# EAGLE design DJ CONTROLLER (EAGLE 7.6.0)
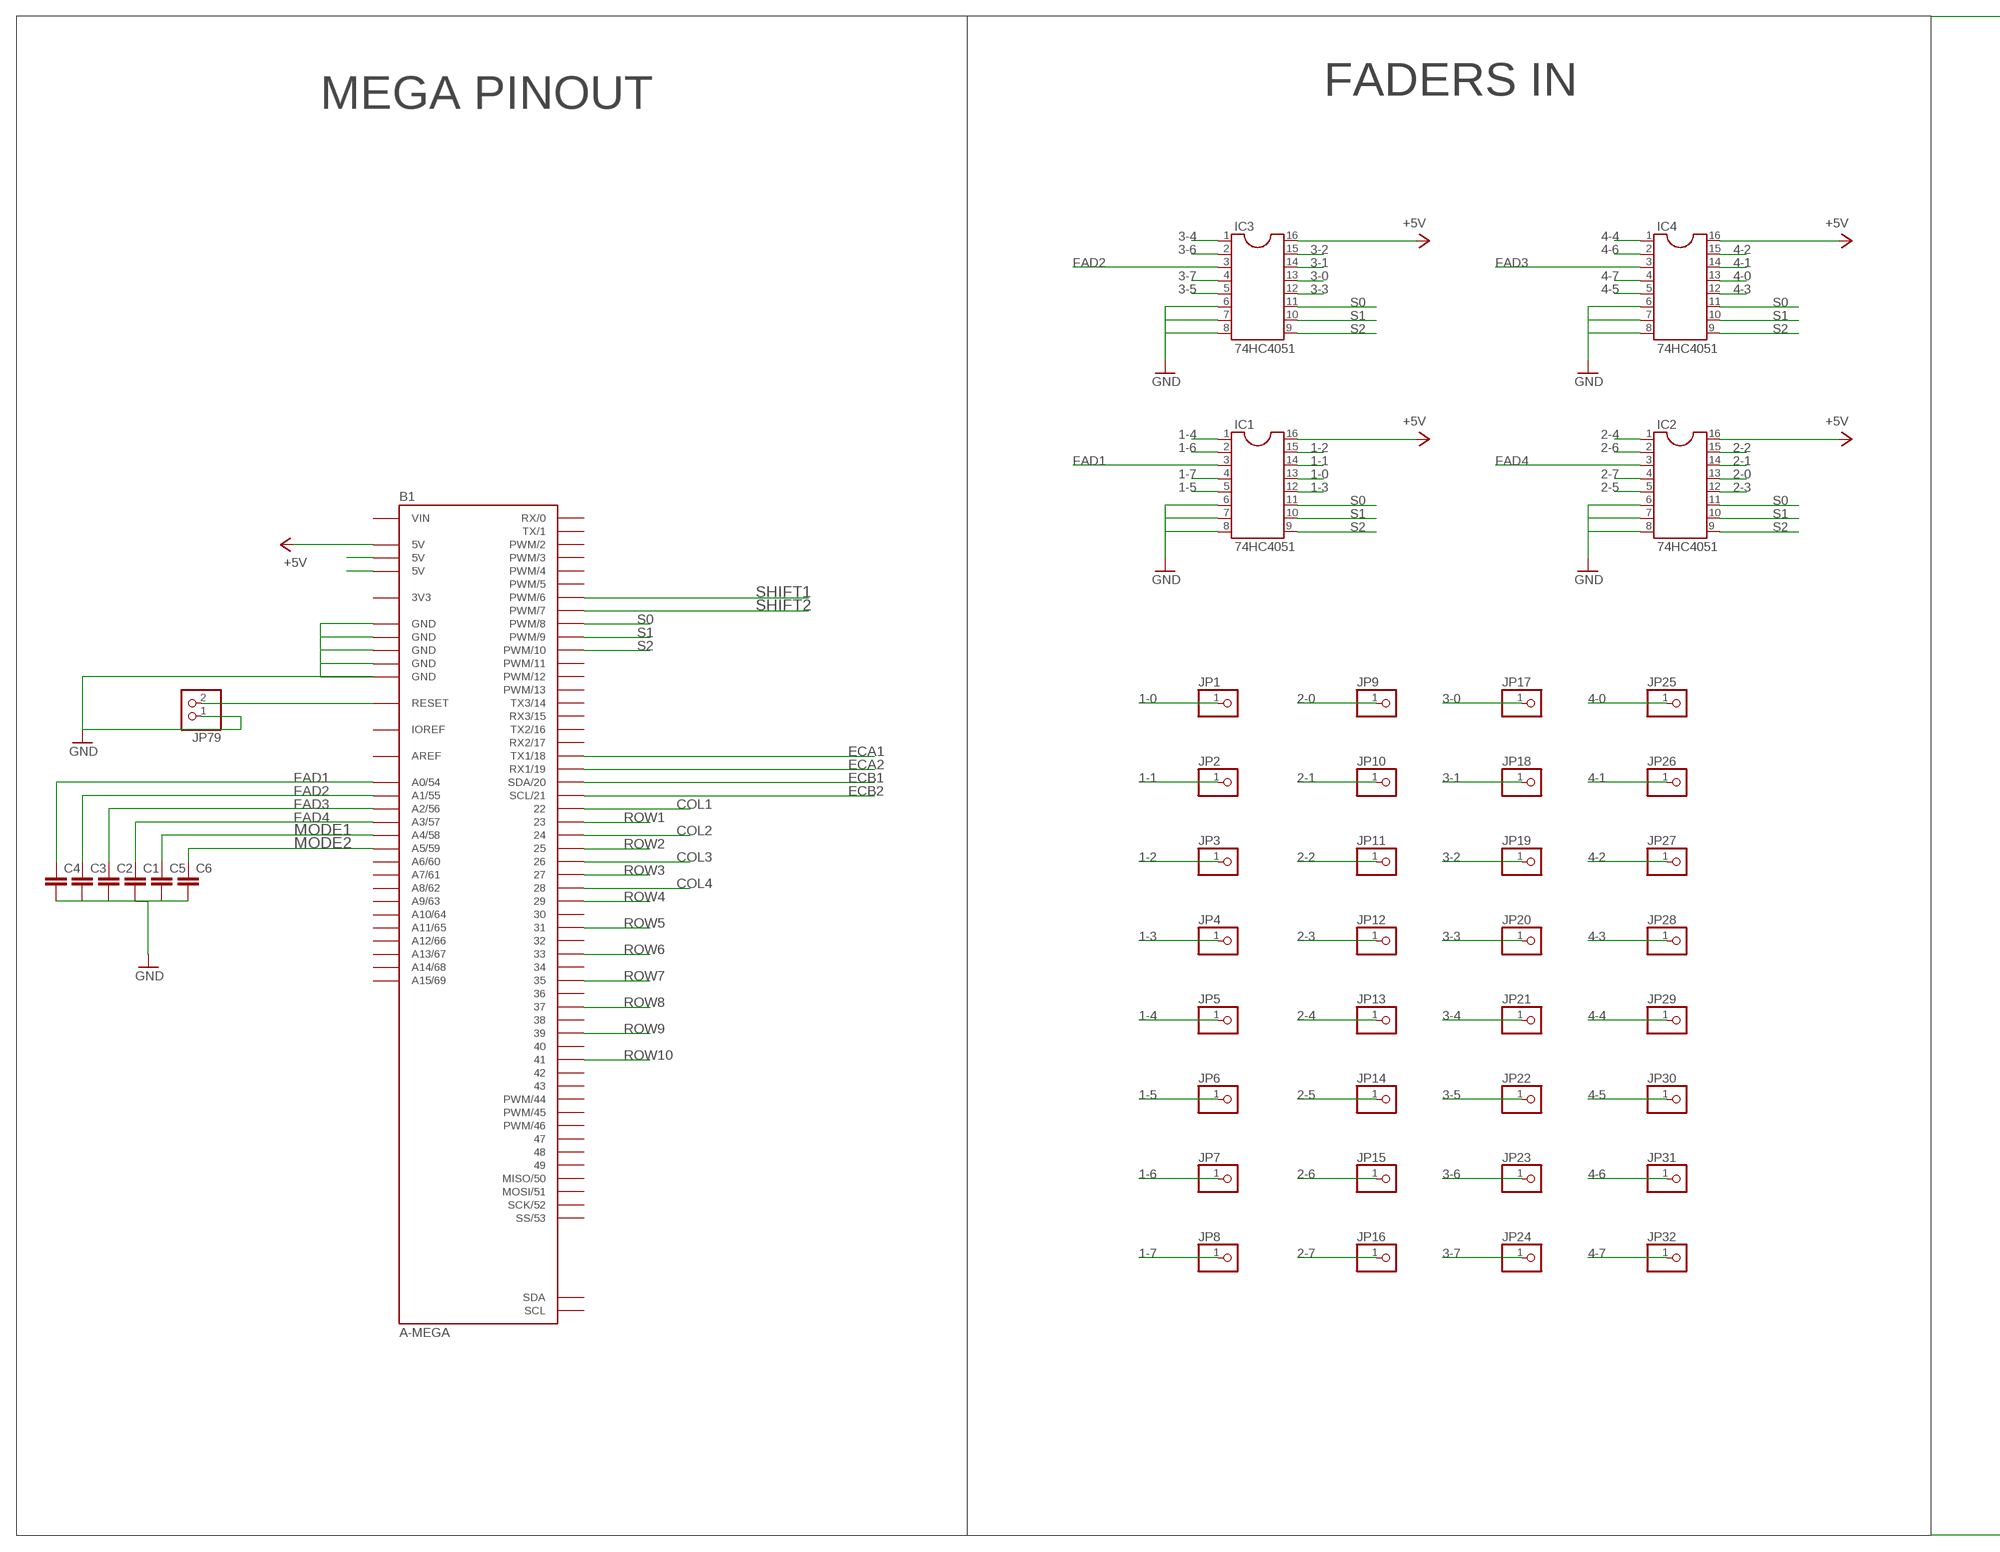
[diagram p0: schematic, sheet 1, part 1 of 2]
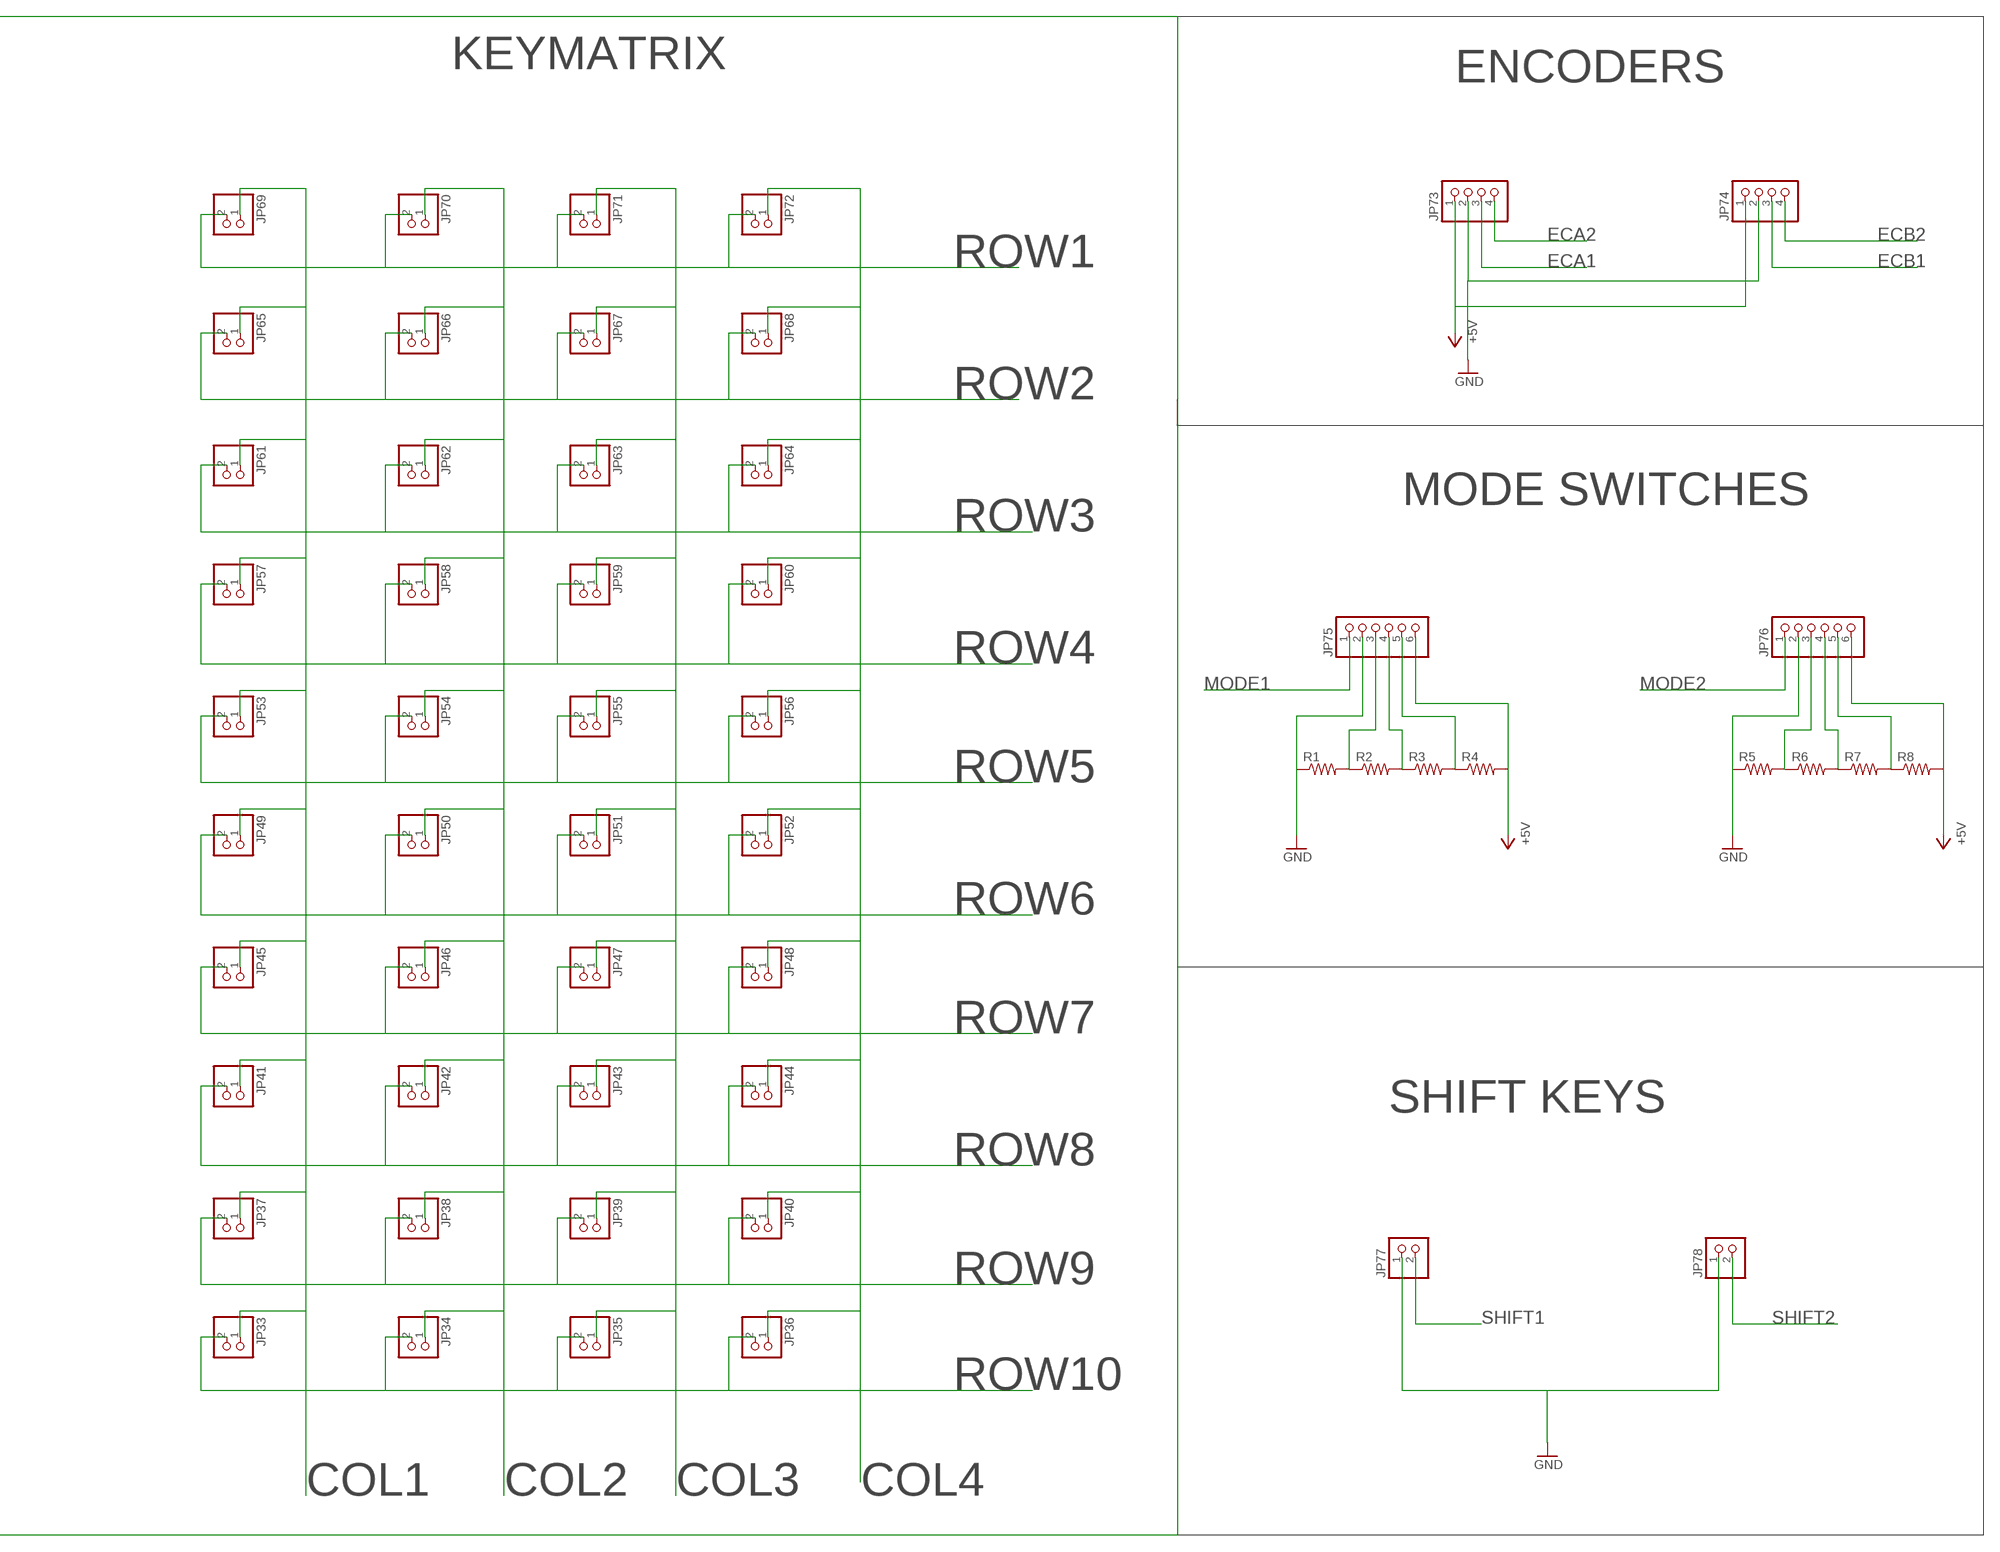
[diagram p1: schematic, sheet 1, part 2 of 2]

## Parts
B1  A-MEGA  [A-MEGA]
C1  C-EU050-025X075  [C050-025X075]
C2  C-EU050-025X075  [C050-025X075]
C3  C-EU050-025X075  [C050-025X075]
C4  C-EU050-025X075  [C050-025X075]
C5  C-EU050-025X075  [C050-025X075]
C6  C-EU050-025X075  [C050-025X075]
IC1  74HC4051  DIL16S  [SOCKET-16]
IC2  74HC4051  DIL16S  [SOCKET-16]
IC3  74HC4051  DIL16S  [SOCKET-16]
IC4  74HC4051  DIL16S  [SOCKET-16]
JP1  PINHD-1X1  [1X01]
JP2  PINHD-1X1  [1X01]
JP3  PINHD-1X1  [1X01]
JP4  PINHD-1X1  [1X01]
JP5  PINHD-1X1  [1X01]
JP6  PINHD-1X1  [1X01]
JP7  PINHD-1X1  [1X01]
JP8  PINHD-1X1  [1X01]
JP9  PINHD-1X1  [1X01]
JP10  PINHD-1X1  [1X01]
JP11  PINHD-1X1  [1X01]
JP12  PINHD-1X1  [1X01]
JP13  PINHD-1X1  [1X01]
JP14  PINHD-1X1  [1X01]
JP15  PINHD-1X1  [1X01]
JP16  PINHD-1X1  [1X01]
JP17  PINHD-1X1  [1X01]
JP18  PINHD-1X1  [1X01]
JP19  PINHD-1X1  [1X01]
JP20  PINHD-1X1  [1X01]
JP21  PINHD-1X1  [1X01]
JP22  PINHD-1X1  [1X01]
JP23  PINHD-1X1  [1X01]
JP24  PINHD-1X1  [1X01]
JP25  PINHD-1X1  [1X01]
JP26  PINHD-1X1  [1X01]
JP27  PINHD-1X1  [1X01]
JP28  PINHD-1X1  [1X01]
JP29  PINHD-1X1  [1X01]
JP30  PINHD-1X1  [1X01]
JP31  PINHD-1X1  [1X01]
JP32  PINHD-1X1  [1X01]
JP33  PINHD-1X2  [1X02]
JP34  PINHD-1X2  [1X02]
JP35  PINHD-1X2  [1X02]
JP36  PINHD-1X2  [1X02]
JP37  PINHD-1X2  [1X02]
JP38  PINHD-1X2  [1X02]
JP39  PINHD-1X2  [1X02]
JP40  PINHD-1X2  [1X02]
JP41  PINHD-1X2  [1X02]
JP42  PINHD-1X2  [1X02]
JP43  PINHD-1X2  [1X02]
JP44  PINHD-1X2  [1X02]
JP45  PINHD-1X2  [1X02]
JP46  PINHD-1X2  [1X02]
JP47  PINHD-1X2  [1X02]
JP48  PINHD-1X2  [1X02]
JP49  PINHD-1X2  [1X02]
JP50  PINHD-1X2  [1X02]
JP51  PINHD-1X2  [1X02]
JP52  PINHD-1X2  [1X02]
JP53  PINHD-1X2  [1X02]
JP54  PINHD-1X2  [1X02]
JP55  PINHD-1X2  [1X02]
JP56  PINHD-1X2  [1X02]
JP57  PINHD-1X2  [1X02]
JP58  PINHD-1X2  [1X02]
JP59  PINHD-1X2  [1X02]
JP60  PINHD-1X2  [1X02]
JP61  PINHD-1X2  [1X02]
JP62  PINHD-1X2  [1X02]
JP63  PINHD-1X2  [1X02]
JP64  PINHD-1X2  [1X02]
JP65  PINHD-1X2  [1X02]
JP66  PINHD-1X2  [1X02]
JP67  PINHD-1X2  [1X02]
JP68  PINHD-1X2  [1X02]
JP69  PINHD-1X2  [1X02]
JP70  PINHD-1X2  [1X02]
JP71  PINHD-1X2  [1X02]
JP72  PINHD-1X2  [1X02]
JP73  PINHD-1X4  [1X04]
JP74  PINHD-1X4  [1X04]
JP75  PINHD-1X6  [1X06]
JP76  PINHD-1X6  [1X06]
JP77  PINHD-1X2  [1X02]
JP78  PINHD-1X2  [1X02]
JP79  PINHD-1X2  [1X02]
R1  R-US_0204/7  [0204/7]
R2  R-US_0204/7  [0204/7]
R3  R-US_0204/7  [0204/7]
R4  R-US_0204/7  [0204/7]
R5  R-US_0204/7  [0204/7]
R6  R-US_0204/7  [0204/7]
R7  R-US_0204/7  [0204/7]
R8  R-US_0204/7  [0204/7]

## Nets
1-0: IC1.13 JP1.1
1-1: IC1.14 JP2.1
1-2: IC1.15 JP3.1
1-3: IC1.12 JP4.1
1-4: IC1.1 JP5.1
1-5: IC1.5 JP6.1
1-6: IC1.2 JP7.1
1-7: IC1.4 JP8.1
2-0: IC2.13 JP9.1
2-1: IC2.14 JP10.1
2-2: IC2.15 JP11.1
2-3: IC2.12 JP12.1
2-4: IC2.1 JP13.1
2-5: IC2.5 JP14.1
2-6: IC2.2 JP15.1
2-7: IC2.4 JP16.1
3-0: IC3.13 JP17.1
3-1: IC3.14 JP18.1
3-2: IC3.15 JP19.1
3-3: IC3.12 JP20.1
3-4: IC3.1 JP21.1
3-5: IC3.5 JP22.1
3-6: IC3.2 JP23.1
3-7: IC3.4 JP24.1
4-0: IC4.13 JP25.1
4-1: IC4.14 JP26.1
4-2: IC4.15 JP27.1
4-3: IC4.12 JP28.1
4-4: IC4.1 JP29.1
4-5: IC4.5 JP30.1
4-6: IC4.2 JP31.1
4-7: IC4.4 JP32.1
+5V: B1.5V@1(5V) IC1.16 IC2.16 IC3.16 IC4.16 JP73.1 JP74.1 JP75.6 JP76.6 R4.2 R8.2
COL1: B1.22 JP33.1 JP37.1 JP41.1 JP45.1 JP49.1 JP53.1 JP57.1 JP61.1 JP65.1 JP69.1
COL2: B1.24 JP34.1 JP38.1 JP42.1 JP46.1 JP50.1 JP54.1 JP58.1 JP62.1 JP66.1 JP70.1
COL3: B1.26 JP35.1 JP39.1 JP43.1 JP47.1 JP51.1 JP55.1 JP59.1 JP63.1 JP67.1 JP71.1
COL4: B1.28 JP36.1 JP40.1 JP44.1 JP48.1 JP52.1 JP56.1 JP60.1 JP64.1 JP68.1 JP72.1
ECA1: B1.18(TX1/18) JP73.3
ECA2: B1.19(RX1/19) JP73.4
ECB1: B1.20(SDA/20) JP74.3
ECB2: B1.21(SCL/21) JP74.4
FAD1: B1.A0(A0/54) C4.1 IC1.3
FAD2: B1.A1(A1/55) C3.1 IC3.3
FAD3: B1.A2(A2/56) C2.1 IC4.3
FAD4: B1.A3(A3/57) C1.1 IC2.3
GND: B1.GND@1(GND) B1.GND@2(GND) B1.GND@3(GND) B1.GND@4(GND) B1.GND@5(GND) C1.2 C2.2 C3.2 C4.2 C5.2 C6.2 IC1.6 IC1.7 IC1.8 IC2.6 IC2.7 IC2.8 IC3.6 IC3.7 IC3.8 IC4.6 IC4.7 IC4.8 JP73.2 JP74.2 JP75.2 JP76.2 JP77.1 JP78.1 JP79.1 R1.1 R5.1
MODE1: B1.A4(A4/58) C5.1 JP75.1
MODE2: B1.A5(A5/59) C6.1 JP76.1
N$34: JP76.3 R5.2 R6.1
N$35: JP75.3 R1.2 R2.1
N$36: JP75.4 R2.2 R3.1
N$37: JP75.5 R3.2 R4.1
N$38: JP76.4 R6.2 R7.1
N$39: JP76.5 R7.2 R8.1
N$41: B1.5V@2(5V)
N$42: B1.5V@3(5V)
N$43: B1.RST(RESET) JP79.2
ROW1: B1.23 JP69.2 JP70.2 JP71.2 JP72.2
ROW2: B1.25 JP65.2 JP66.2 JP67.2 JP68.2
ROW3: B1.27 JP61.2 JP62.2 JP63.2 JP64.2
ROW4: B1.29 JP57.2 JP58.2 JP59.2 JP60.2
ROW5: B1.31 JP53.2 JP54.2 JP55.2 JP56.2
ROW6: B1.33 JP49.2 JP50.2 JP51.2 JP52.2
ROW7: B1.35 JP45.2 JP46.2 JP47.2 JP48.2
ROW8: B1.37 JP41.2 JP42.2 JP43.2 JP44.2
ROW9: B1.39 JP37.2 JP38.2 JP39.2 JP40.2
ROW10: B1.41 JP33.2 JP34.2 JP35.2 JP36.2
S0: B1.8(PWM/8) IC1.11 IC2.11 IC3.11 IC4.11
S1: B1.9(PWM/9) IC1.10 IC2.10 IC3.10 IC4.10
S2: B1.10(PWM/10) IC1.9 IC2.9 IC3.9 IC4.9
SHIFT1: B1.6(PWM/6) JP77.2
SHIFT2: B1.7(PWM/7) JP78.2
Unconnected: B1.0(RX/0) B1.1(TX/1) B1.2(PWM/2) B1.3(PWM/3) B1.4(PWM/4) B1.5(PWM/5) B1.11(PWM/11) B1.12(PWM/12) B1.13(PWM/13) B1.14(TX3/14) B1.15(RX3/15) B1.16(TX2/16) B1.17(RX2/17) B1.30 B1.32 B1.34 B1.36 B1.38 B1.40 B1.42 B1.43 B1.44(PWM/44) B1.45(PWM/45) B1.46(PWM/46) B1.47 B1.48 B1.49 B1.50(MISO/50) B1.51(MOSI/51) B1.52(SCK/52) B1.53(SS/53) B1.A6(A6/60) B1.A7(A7/61) B1.A8(A8/62) B1.A9(A9/63) B1.A10(A10/64) B1.A11(A11/65) B1.A12(A12/66) B1.A13(A13/67) B1.A14(A14/68) B1.A15(A15/69) B1.SCL B1.SDA

## Notes on the sheet
- KEYMATRIX | ENCODERS
- MEGA PINOUT | FADERS IN
- MODE SWITCHES
- SHIFT KEYS

## Power pins joined to a net without a drawn wire
3V3: B1.3V3
AREF: B1.AREF
IOREF: B1.IOREF
VIN: B1.VIN

## Library data of the parts
B1 = we-board:A-MEGA: Arduino/Genuino Mega
C1-C6 = resistor:C-EU: CAPACITOR, European symbol
IC1-IC4 = ic-package:DIL16: Dual In Line / Socket
JP1-JP32 = pinhead:PINHD-1X1: PIN HEADER
JP33-JP72 JP77-JP79 = pinhead:PINHD-1X2: PIN HEADER
JP73 JP74 = pinhead:PINHD-1X4: PIN HEADER
JP75 JP76 = pinhead:PINHD-1X6: PIN HEADER
R1-R8 = resistor:R-US_: RESISTOR, American symbol

## Board
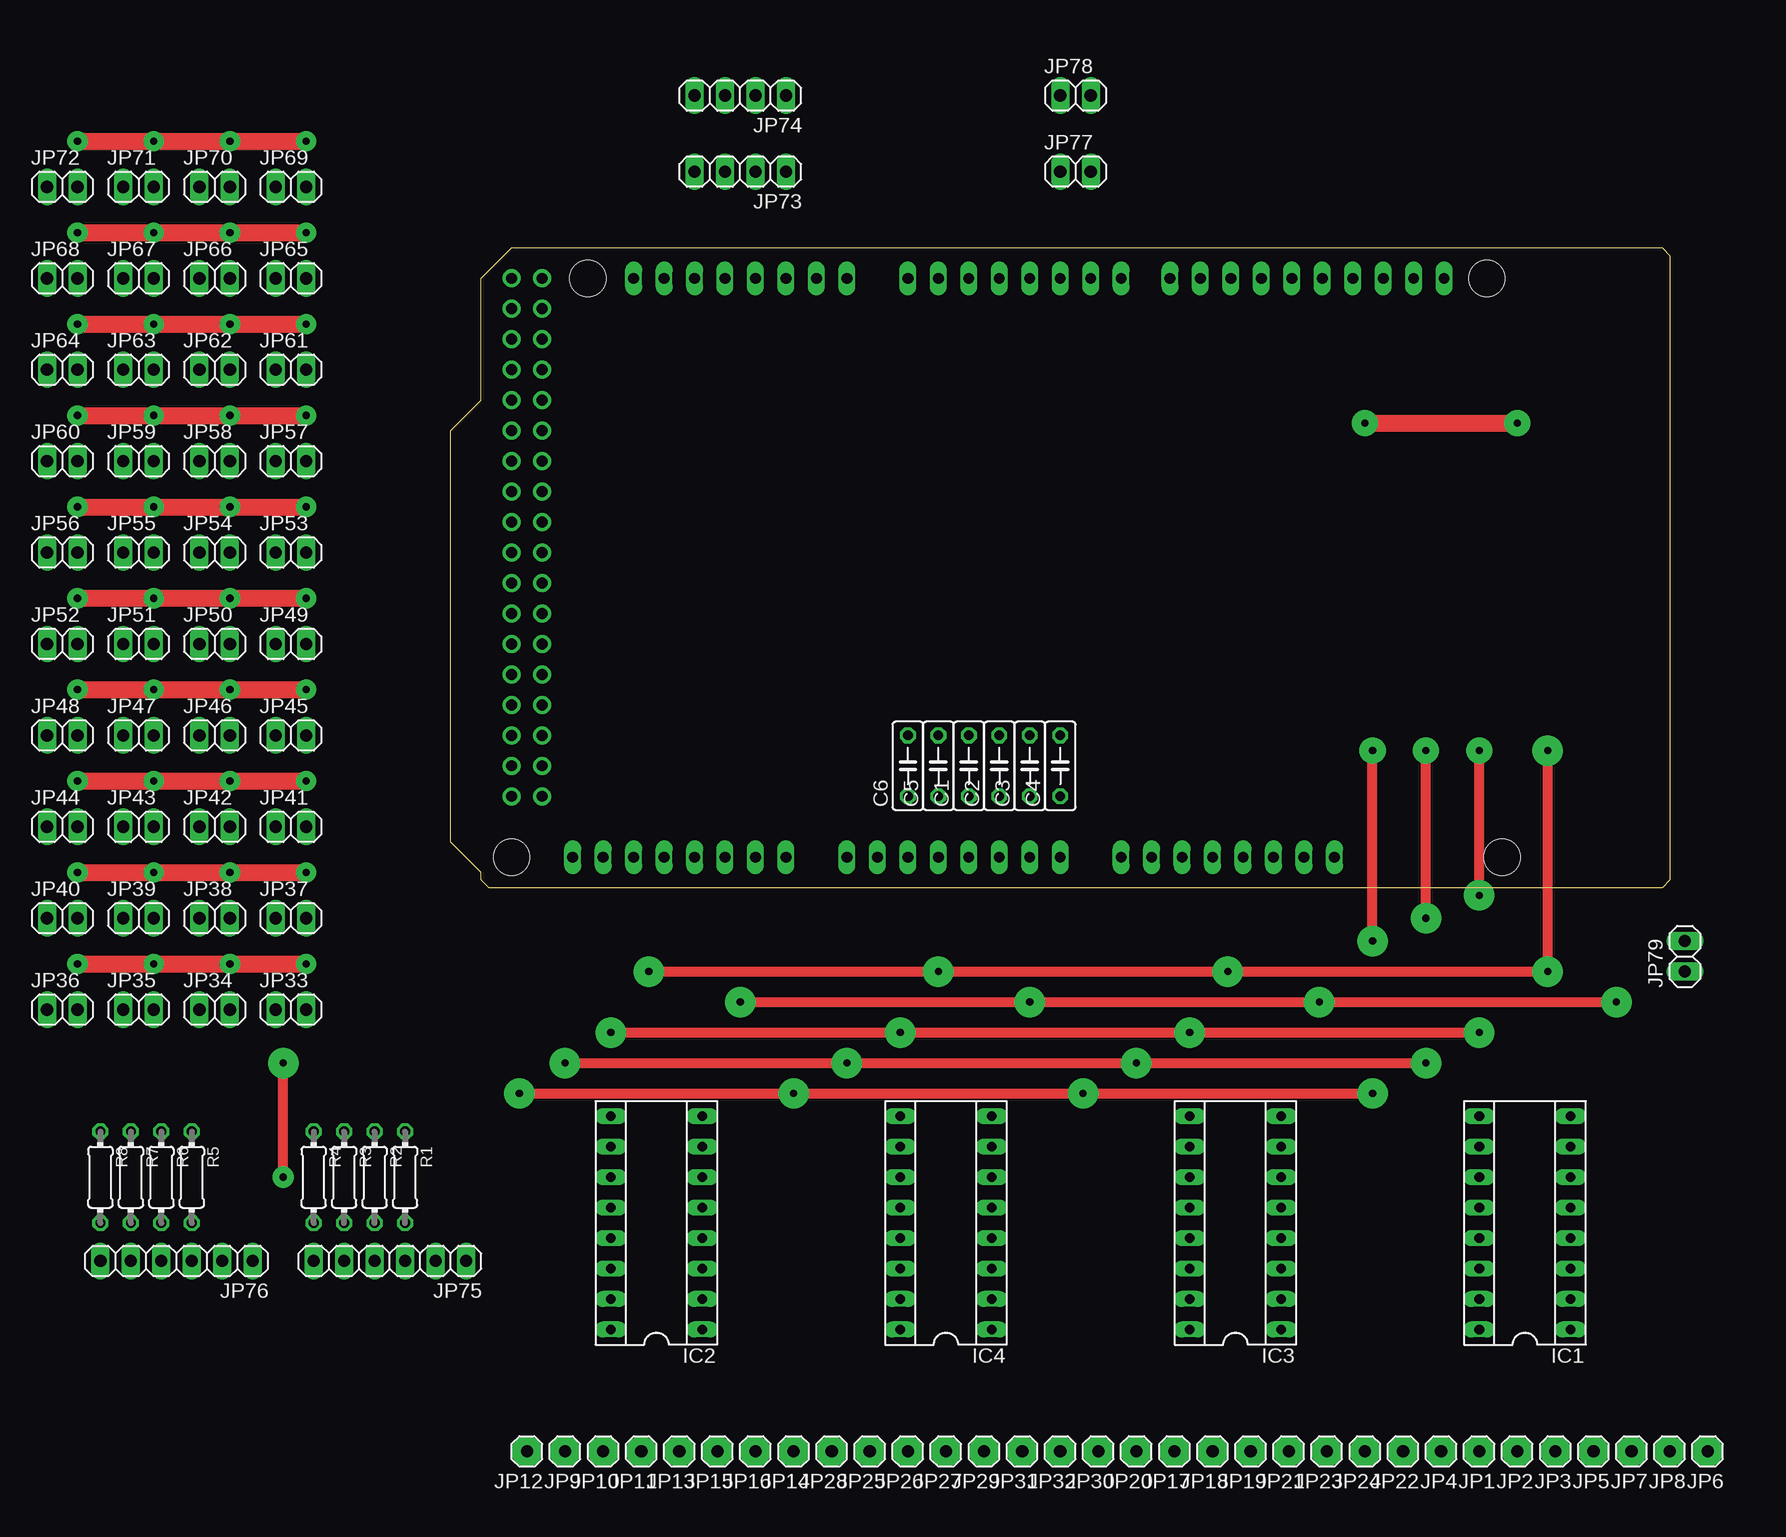
[diagram p2: board, top side]
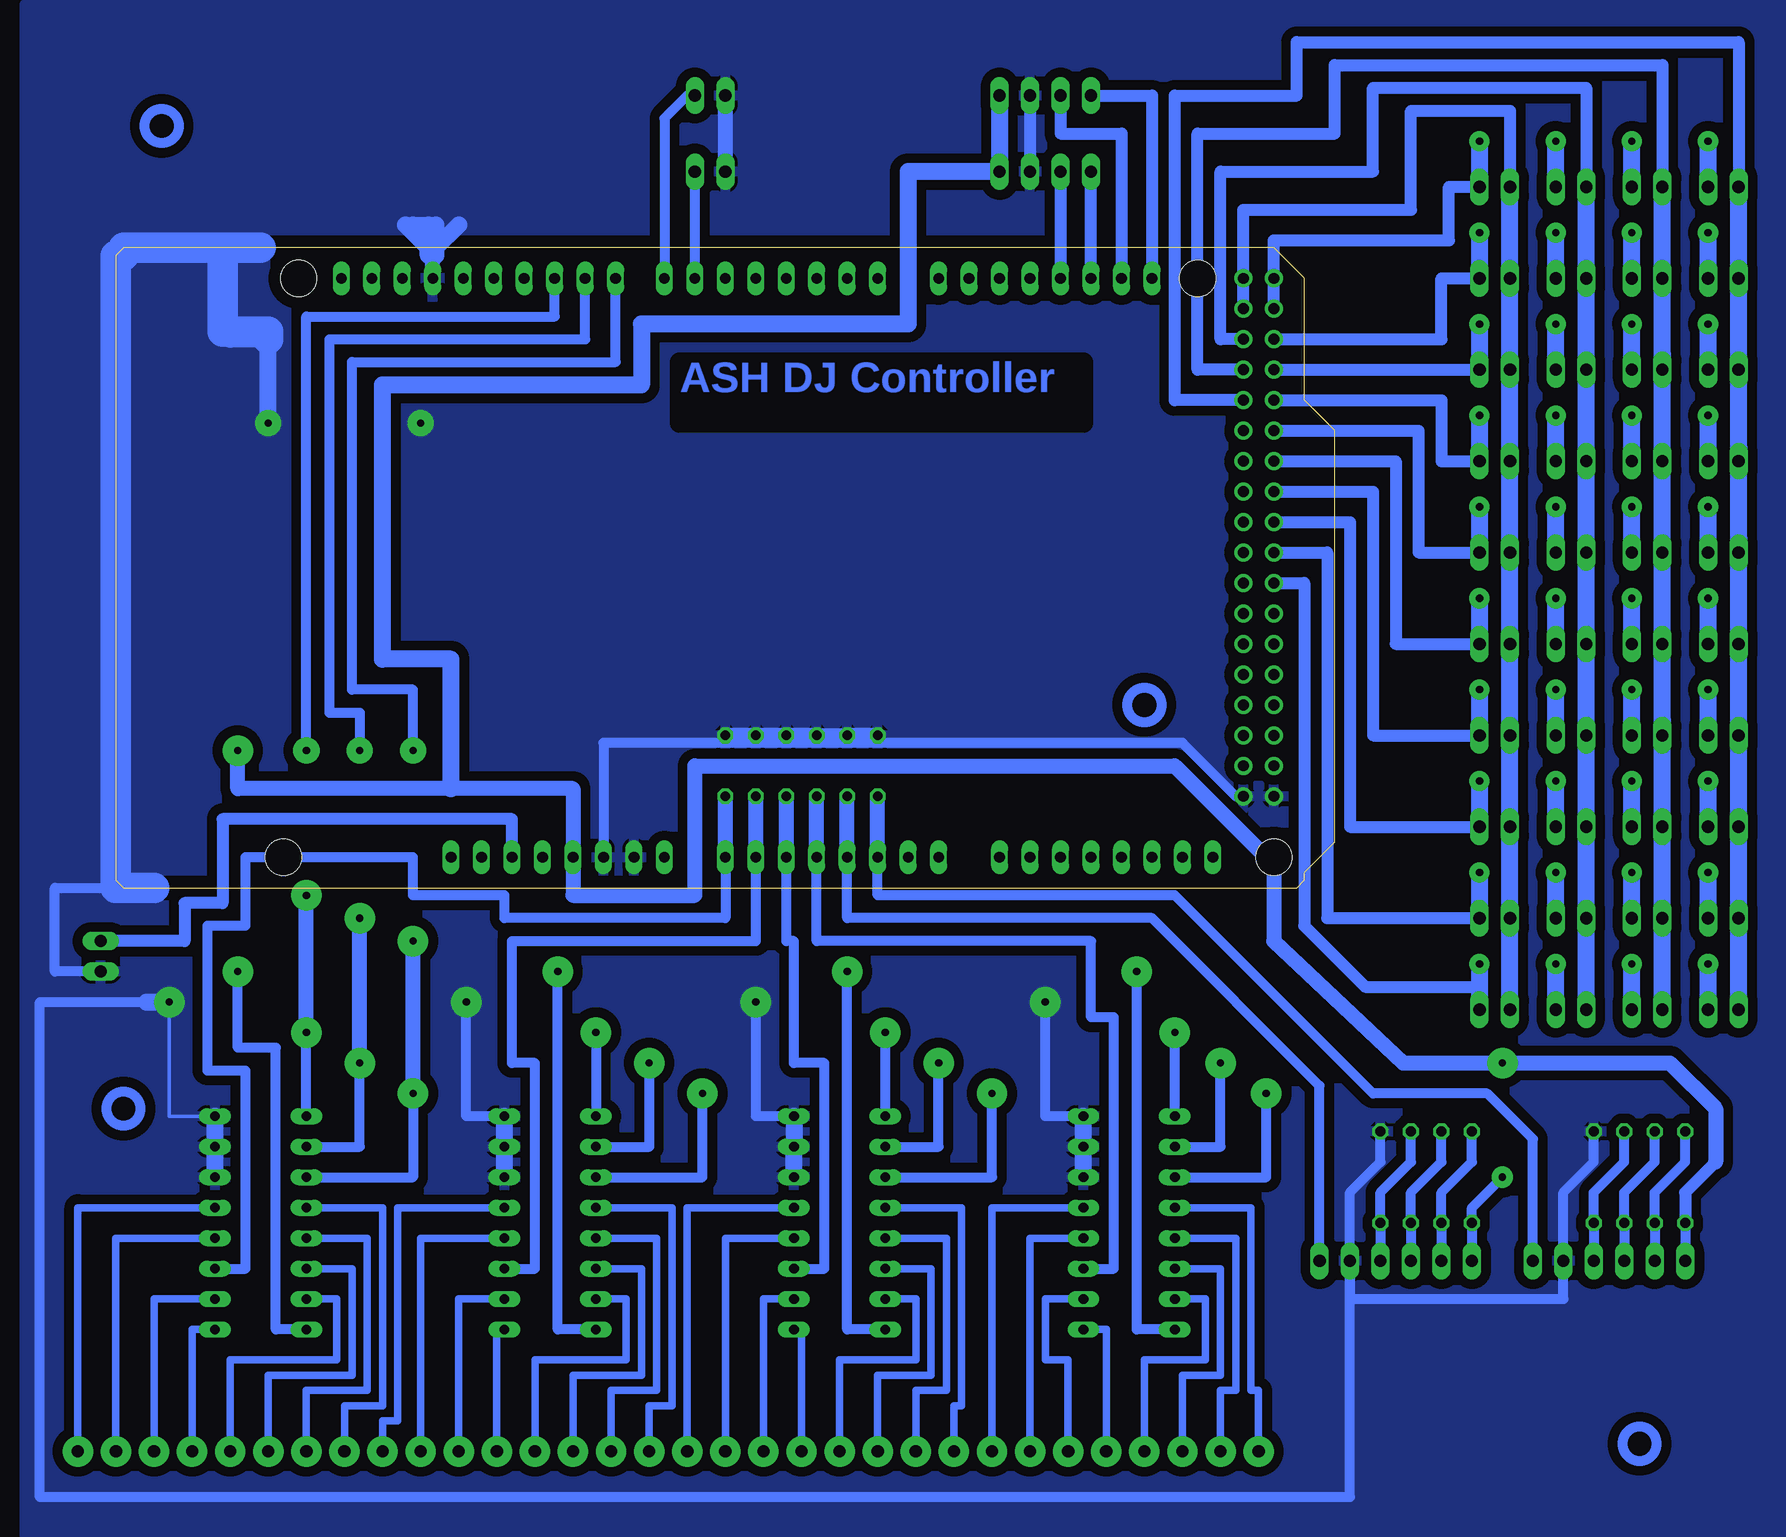
[diagram p3: board, bottom side, seen from below]

Size 101.6 x 53.34 mm. Coordinates in mm from the lower left corner, seen from the top.
Copper layers (1*16): Top 0.035mm / dielectric 1.5mm / Bottom 0.035mm
Design rules "default": minimum track width 10mil, minimum drill 24mil, track to track 8mil, track to pad 8mil, pad to pad 8mil, via to via 8mil, smd to smd 8mil, copper to edge 40mil, drill to drill 8mil, minimum pad ring 10mil, minimum via ring 8mil, stop-mask expansion 4mil, vias tented up to drill 0mil, thermal gap 10mil

### Footprints (pad centres in the part's own frame; a part is rotated, then mirrored left to right if it is on the bottom)
A-MEGA = drill 0.9 pad 1.2 long: 0 63.5,50.8; 1 60.96,50.8; 2 58.42,50.8; 3 55.88,50.8; 3V3 35.56,2.54; 4 53.34,50.8; 5 50.8,50.8; 5V@1 38.1,2.54; 6 48.26,50.8; 7 45.72,50.8; 8 41.656,50.8; 9 39.116,50.8; 10 36.576,50.8; 11 34.036,50.8; 12 31.496,50.8; 13 28.956,50.8; 14 68.58,50.8; 15 71.12,50.8; 16 73.66,50.8; 17 76.2,50.8; 18 78.74,50.8; 19 81.28,50.8; 20 83.82,50.8; 21 86.36,50.8; A0 50.8,2.54; A1 53.34,2.54; A2 55.88,2.54; A3 58.42,2.54; A4 60.96,2.54; A5 63.5,2.54; A6 66.04,2.54; A7 68.58,2.54; A8 73.66,2.54; A9 76.2,2.54; A10 78.74,2.54; A11 81.28,2.54; A12 83.82,2.54; A13 86.36,2.54; A14 88.9,2.54; A15 91.44,2.54; AREF 23.876,50.8; GND@1 40.64,2.54; GND@2 43.18,2.54; GND@3 26.416,50.8; IOREF 30.48,2.54; NC 27.94,2.54; RST 33.02,2.54; SCL 18.796,50.8; SDA 21.336,50.8; VIN 45.72,2.54 | drill 0.9 pad 1.5: 5V@2 93.98,50.8; 5V@3 96.52,50.8; 22 93.98,48.26; 23 96.52,48.26; 24 93.98,45.72; 25 96.52,45.72; 26 93.98,43.18; 27 96.52,43.18; 28 93.98,40.64; 29 96.52,40.64; 30 93.98,38.1; 31 96.52,38.1; 32 93.98,35.56; 33 96.52,35.56; 34 93.98,33.02; 35 96.52,33.02; 36 93.98,30.48; 37 96.52,30.48; 38 93.98,27.94; 39 96.52,27.94; 40 93.98,25.4; 41 96.52,25.4; 42 93.98,22.86; 43 96.52,22.86; 44 93.98,20.32; 45 96.52,20.32; 46 93.98,17.78; 47 96.52,17.78; 48 93.98,15.24; 49 96.52,15.24; 50 93.98,12.7; 51 96.52,12.7; 52 93.98,10.16; 53 96.52,10.16; GND@4 93.98,7.62; GND@5 96.52,7.62 | hole 3: 90.17,50.8; 96.52,2.54; 15.24,50.8; 13.97,2.54
C050-025X075 = drill 0.813 octagon: 1 -2.54,0; 2 2.54,0
SOCKET-16 = drill 0.813 long: 1 -8.89,-3.81; 2 -6.35,-3.81; 3 -3.81,-3.81; 4 -1.27,-3.81; 5 1.27,-3.81; 6 3.81,-3.81; 7 6.35,-3.81; 8 8.89,-3.81; 9 8.89,3.81; 10 6.35,3.81; 11 3.81,3.81; 12 1.27,3.81; 13 -1.27,3.81; 14 -3.81,3.81; 15 -6.35,3.81; 16 -8.89,3.81
1X01 = drill 1.016 octagon: 1 0,0
1X02 = drill 1.016 long: 1 -1.27,0; 2 1.27,0
1X04 = drill 1.016 long: 1 -3.81,0; 2 -1.27,0; 3 1.27,0; 4 3.81,0
1X06 = drill 1.016 long: 1 -6.35,0; 2 -3.81,0; 3 -1.27,0; 4 1.27,0; 5 3.81,0; 6 6.35,0
0204/7 = drill 0.813 octagon: 1 -3.81,0; 2 3.81,0

### Placement (x,y rotation side)
B1  101.6,0 0 bottom
C1  43.18,10.16 90 top
C2  45.72,10.16 90 top
C3  48.26,10.16 90 top
C4  50.8,10.16 90 top
C5  40.64,10.16 90 top
C6  38.1,10.16 90 top
IC1  89.53,-27.94 90 top  (outside the outline)
IC2  17.14,-27.94 90 top  (outside the outline)
IC3  65.4,-27.94 90 top  (outside the outline)
IC4  41.27,-27.94 90 top  (outside the outline)
JP1  85.72,-46.99 180 top  (outside the outline)
JP2  88.9,-46.99 180 top  (outside the outline)
JP3  92.07,-46.99 180 top  (outside the outline)
JP4  82.55,-46.99 180 top  (outside the outline)
JP5  95.25,-46.99 180 top  (outside the outline)
JP6  104.77,-46.99 180 top  (outside the outline)
JP7  98.42,-46.99 180 top  (outside the outline)
JP8  101.6,-46.99 180 top  (outside the outline)
JP9  9.52,-46.99 180 top  (outside the outline)
JP10  12.7,-46.99 180 top  (outside the outline)
JP11  15.87,-46.99 180 top  (outside the outline)
JP12  6.35,-46.99 180 top  (outside the outline)
JP13  19.05,-46.99 180 top  (outside the outline)
JP14  28.57,-46.99 180 top  (outside the outline)
JP15  22.22,-46.99 180 top  (outside the outline)
JP16  25.4,-46.99 180 top  (outside the outline)
JP17  60.32,-46.99 180 top  (outside the outline)
JP18  63.5,-46.99 180 top  (outside the outline)
JP19  66.67,-46.99 180 top  (outside the outline)
JP20  57.15,-46.99 180 top  (outside the outline)
JP21  69.85,-46.99 180 top  (outside the outline)
JP22  79.37,-46.99 180 top  (outside the outline)
JP23  73.02,-46.99 180 top  (outside the outline)
JP24  76.2,-46.99 180 top  (outside the outline)
JP25  34.92,-46.99 180 top  (outside the outline)
JP26  38.1,-46.99 180 top  (outside the outline)
JP27  41.27,-46.99 180 top  (outside the outline)
JP28  31.75,-46.99 180 top  (outside the outline)
JP29  44.45,-46.99 180 top  (outside the outline)
JP30  53.97,-46.99 180 top  (outside the outline)
JP31  47.62,-46.99 180 top  (outside the outline)
JP32  50.8,-46.99 180 top  (outside the outline)
JP33  -13.34,-10.16 0 top  (outside the outline)
JP34  -19.69,-10.16 0 top  (outside the outline)
JP35  -26.04,-10.16 0 top  (outside the outline)
JP36  -32.39,-10.16 0 top  (outside the outline)
JP37  -13.34,-2.54 0 top  (outside the outline)
JP38  -19.69,-2.54 0 top  (outside the outline)
JP39  -26.04,-2.54 0 top  (outside the outline)
JP40  -32.39,-2.54 0 top  (outside the outline)
JP41  -13.34,5.08 0 top  (outside the outline)
JP42  -19.69,5.08 0 top  (outside the outline)
JP43  -26.04,5.08 0 top  (outside the outline)
JP44  -32.39,5.08 0 top  (outside the outline)
JP45  -13.34,12.7 0 top  (outside the outline)
JP46  -19.69,12.7 0 top  (outside the outline)
JP47  -26.04,12.7 0 top  (outside the outline)
JP48  -32.39,12.7 0 top  (outside the outline)
JP49  -13.34,20.32 0 top  (outside the outline)
JP50  -19.69,20.32 0 top  (outside the outline)
JP51  -26.04,20.32 0 top  (outside the outline)
JP52  -32.39,20.32 0 top  (outside the outline)
JP53  -13.34,27.94 0 top  (outside the outline)
JP54  -19.69,27.94 0 top  (outside the outline)
JP55  -26.04,27.94 0 top  (outside the outline)
JP56  -32.39,27.94 0 top  (outside the outline)
JP57  -13.34,35.56 0 top  (outside the outline)
JP58  -19.69,35.56 0 top  (outside the outline)
JP59  -26.04,35.56 0 top  (outside the outline)
JP60  -32.39,35.56 0 top  (outside the outline)
JP61  -13.34,43.18 0 top  (outside the outline)
JP62  -19.69,43.18 0 top  (outside the outline)
JP63  -26.04,43.18 0 top  (outside the outline)
JP64  -32.39,43.18 0 top  (outside the outline)
JP65  -13.34,50.8 0 top  (outside the outline)
JP66  -19.69,50.8 0 top  (outside the outline)
JP67  -26.04,50.8 0 top  (outside the outline)
JP68  -32.39,50.8 0 top  (outside the outline)
JP69  -13.34,58.42 0 top  (outside the outline)
JP70  -19.69,58.42 0 top  (outside the outline)
JP71  -26.04,58.42 0 top  (outside the outline)
JP72  -32.39,58.42 0 top  (outside the outline)
JP73  24.13,59.69 180 top  (outside the outline)
JP74  24.13,66.04 180 top  (outside the outline)
JP75  -5.08,-31.11 180 top  (outside the outline)
JP76  -22.86,-31.11 180 top  (outside the outline)
JP77  52.07,59.69 0 top  (outside the outline)
JP78  52.07,66.04 0 top  (outside the outline)
JP79  102.87,-5.71 90 top  (outside the outline)
R1  -3.81,-24.13 270 top  (outside the outline)
R2  -6.35,-24.13 270 top  (outside the outline)
R3  -8.89,-24.13 270 top  (outside the outline)
R4  -11.43,-24.13 270 top  (outside the outline)
R5  -21.59,-24.13 270 top  (outside the outline)
R6  -24.13,-24.13 270 top  (outside the outline)
R7  -26.67,-24.13 270 top  (outside the outline)
R8  -29.21,-24.13 270 top  (outside the outline)

### Tracks (layer width: path | path; a pad name or v marks a point on that pad's centre or on a via)
1-0
  Bottom 0.61: IC1.13 80.64,-29.21 80.64,-41.91 85.72,-41.91 JP1.1
1-1
  Bottom 0.61: IC1.14 81.91,-31.75 81.91,-40.64 88.9,-40.64 JP2.1
1-2
  Bottom 0.61: IC1.15 83.18,-34.29 83.18,-39.37 92.07,-39.37 JP3.1
1-3
  Bottom 0.61: IC1.12 79.37,-26.67 79.37,-43.18 82.55,-43.18 JP4.1
1-4
  Bottom 0.61: IC1.1 95.25,-36.83 JP5.1
1-5
  Bottom 0.61: JP6.1 104.77,-26.67 IC1.5
1-6
  Bottom 0.61: JP7.1 98.42,-34.29 IC1.2
1-7
  Bottom 0.61: JP8.1 101.6,-29.21 IC1.4
2-0
  Bottom 0.61: JP9.1 9.52,-41.91 8.25,-41.91 8.25,-29.21 IC2.13
2-1
  Bottom 0.61: JP10.1 12.7,-40.64 9.52,-40.64 9.52,-31.75 IC2.14
2-2
  Bottom 0.61: IC2.15 10.79,-34.29 10.79,-39.37 15.87,-39.37 JP11.1
2-3
  Bottom 0.61: IC2.12 6.98,-26.67 6.98,-41.91 6.35,-41.91 JP12.1
2-4
  Bottom 0.61: JP13.1 19.05,-36.83 IC2.1
2-5
  Bottom 0.61: JP14.1 28.57,-26.67 IC2.5
2-6
  Bottom 0.61: IC2.2 24.13,-34.29 24.13,-39.37 22.22,-39.37 JP15.1
2-7
  Bottom 0.61: JP16.1 25.4,-29.21 IC2.4
3-0
  Bottom 0.61: IC3.13 56.51,-29.21 56.51,-41.91 60.32,-41.91 JP17.1
3-1
  Bottom 0.61: IC3.14 57.78,-31.75 57.78,-40.64 63.5,-40.64 JP18.1
3-2
  Bottom 0.61: IC3.15 59.05,-34.29 59.05,-39.37 66.67,-39.37 JP19.1
3-3
  Bottom 0.61: IC3.12 55.24,-26.67 55.24,-43.18 57.15,-43.18 JP20.1
3-4
  Bottom 0.61: IC3.1 69.85,-36.83 JP21.1
3-5
  Bottom 0.61: IC3.5 78.1,-26.67 78.1,-44.45 79.37,-44.45 JP22.1
3-6
  Bottom 0.61: JP23.1 73.02,-34.29 IC3.2
3-7
  Bottom 0.61: IC3.4 76.2,-29.21 JP24.1
4-0
  Bottom 0.61: IC4.13 32.38,-29.21 32.38,-41.91 34.92,-41.91 JP25.1
4-1
  Bottom 0.61: IC4.14 33.65,-31.75 33.65,-40.64 38.1,-40.64 JP26.1
4-2
  Bottom 0.61: IC4.15 34.92,-34.29 34.92,-39.37 41.27,-39.37 JP27.1
4-3
  Bottom 0.61: IC4.12 31.11,-26.67 31.11,-43.18 31.75,-43.18 JP28.1
4-4
  Bottom 0.61: JP29.1 44.45,-36.83 IC4.1
4-5
  Bottom 0.61: JP30.1 53.97,-26.67 IC4.5
4-6
  Bottom 0.61: JP31.1 47.62,-34.29 IC4.2
4-7
  Bottom 0.61: JP32.1 50.8,-29.21 IC4.4
+5V  (via drill 0.6 pad 1.78, 0.6 pad 2.54)
  Top 0.813: v16.51,-6.98 v40.64,-6.98 v64.77,-6.98 v91.44,-6.98 v91.44,11.43 | v-13.97,-24.13 v-13.97,-14.6
  Bottom 0.813: JP75.6 R4.2 -11.43,-26.67 v-13.97,-24.13 | R8.2 JP76.6 | IC1.16 88.26,-36.83 88.26,-13.34 91.44,-13.34 v91.44,-6.98 | IC3.16 64.77,-36.83 v64.77,-6.98 | IC4.16 40.64,-36.83 v40.64,-6.98 | IC2.16 16.51,-36.83 v16.51,-6.98
  Bottom 1.016: -31.75,-22.86 -29.21,-25.4 R8.2
  Bottom 1.27: -31.75,-22.86 -31.75,-18.41 -27.94,-14.6 v-13.97,-14.6 -5.72,-14.6 5.08,-4.45 5.08,1.91 13.33,10.16 53.34,10.16 53.34,-0.63 63.5,-0.63 B1.5V@1 63.5,8.26 73.66,8.26 91.44,8.26 v91.44,11.43
  Bottom 1.422: JP74.1 JP73.1 35.56,59.69 35.56,46.99 57.78,46.99 57.78,41.91 79.37,41.91 79.37,19.05 73.66,19.05 73.66,8.26
COL1
  Bottom 1.016: B1.22 7.62,56.52 -6.35,56.52 -6.35,64.77 -14.61,64.77 JP69.1
  Bottom 1.422: JP33.1 JP37.1 JP41.1 JP45.1 JP49.1 JP53.1 JP57.1 JP61.1 JP65.1 JP69.1
COL2
  Bottom 1.016: B1.24 9.52,45.72 9.52,59.69 -3.18,59.69 -3.18,66.67 -20.96,66.67 JP70.1
  Bottom 1.422: JP34.1 JP38.1 JP42.1 JP46.1 JP50.1 JP54.1 JP58.1 JP62.1 JP66.1 JP70.1
COL3
  Bottom 1.016: B1.26 11.43,43.18 11.43,62.86 0,62.86 0,68.58 -27.31,68.58 JP71.1
  Bottom 1.422: JP35.1 JP39.1 JP43.1 JP47.1 | -27.31,13.97 JP47.1 | JP47.1 JP51.1 JP55.1 JP59.1 JP63.1 | -27.31,44.45 JP63.1 | JP63.1 JP67.1 JP71.1
COL4
  Bottom 1.016: B1.28 13.33,40.64 13.33,66.04 3.17,66.04 3.17,70.48 -33.66,70.48 JP72.1
  Bottom 1.422: JP36.1 JP40.1 JP44.1 JP48.1 JP52.1 JP56.1 | -33.66,29.21 JP56.1 | JP56.1 JP60.1 | -33.66,36.83 JP60.1 | JP60.1 JP64.1 JP68.1 JP72.1
ECA1
  Bottom 1.016: JP73.3 B1.18
ECA2
  Bottom 1.016: B1.19 JP73.4
ECB1
  Bottom 1.016: JP74.3 22.86,62.86 17.78,62.86 B1.20
ECB2
  Bottom 1.016: JP74.4 15.24,66.04 B1.21
FAD1
  Bottom 0.813: IC1.3 90.8,-31.75 90.8,-15.24 93.98,-15.24 93.98,-3.17 90.8,-3.17 90.8,2.54 76.83,2.54 76.83,-0.63 69.21,-0.63 69.21,-2.54 50.8,-2.54 B1.A0
  Bottom 1.27: B1.A0 C4.1
FAD2
  Bottom 0.813: IC3.3 66.67,-31.75 66.67,-14.6 68.58,-14.6 68.58,-4.45 48.26,-4.45 B1.A1
  Bottom 1.27: B1.A1 C3.1
FAD3
  Bottom 0.813: IC4.3 42.54,-31.75 42.54,-14.6 45.08,-14.6 45.08,-4.45 45.72,-4.45 B1.A2
  Bottom 1.27: B1.A2 C2.1
FAD4
  Bottom 0.813: IC2.3 18.41,-31.75 18.41,-10.8 20.32,-10.8 20.32,-4.45 43.18,-4.45 B1.A3
  Bottom 1.27: B1.A3 C1.1
GND  (via drill 0.6 pad 1.78, 0.6 pad 2.18, 0.6 pad 2.54)
  Top 0.813: v24.13,-9.52 v48.26,-9.52 v72.39,-9.52 v97.15,-9.52
  Top 1.422: v76.2,38.73 v88.9,38.73
  Bottom 0.305: v97.15,-9.52 97.15,-19.05 IC1.8
  Bottom 0.813: 44.45,-19.05 IC4.8 48.26,-19.05 v48.26,-9.52 | IC3.8 72.39,-19.05 v72.39,-9.52 | IC2.8 24.13,-19.05 v24.13,-9.52 | JP75.2 -1.27,-25.4 -3.81,-22.86 R1.1 | R5.1 -21.59,-22.86 -19.05,-25.4 JP76.2 -19.05,-34.29 -1.27,-34.29 JP75.2 | v97.15,-9.52 107.95,-9.52 107.95,-50.8 -1.27,-50.8 JP75.2 | JP79.1 106.68,-6.98 106.68,0 101.6,0 | B1.GND@4 8.25,7.62 12.7,12.06 60.96,12.06 B1.GND@1
  Bottom 1.016: JP74.2 JP73.2
  Bottom 1.27: JP77.1 JP78.1 | B1.GND@3 75.18,52.7 74.93,52.7 | C6.2 C5.2 C1.2 C2.2 C3.2 C4.2
  Bottom 1.422: IC1.6 IC1.7 IC1.8 | IC3.6 IC3.7 IC3.8 | IC2.6 IC2.7 IC2.8 | IC4.6 IC4.7 IC4.8 | v88.9,38.73 88.9,45.72 92.07,45.72 | 76.83,55.25 75.56,55.25 | 75.56,55.25 74.93,55.25 74.93,52.7 75.56,52.7 75.56,53.34 | 75.56,55.25 75.56,53.34 | 77.47,55.25 75.56,53.34 | 75.56,53.34 74.93,53.34 73.02,55.25 | 99.06,-9.52 v97.15,-9.52
  Bottom 2.54: 89.53,53.34 92.71,53.34 | 92.71,53.34 100.96,53.34 100.96,52.7 101.6,52.7 101.6,0 98.42,0 | 88.9,45.72 88.9,46.36 92.71,46.36 92.71,53.34
  pour Bottom (isolate 0.813): 109.22,-53.98 109.22,73.66 -38.1,73.66 -38.1,-53.98
MODE1
  Bottom 0.813: JP75.1 1.27,-16.51 15.24,-2.54 40.64,-2.54 B1.A4
  Bottom 1.27: B1.A4 C5.1
MODE2
  Bottom 0.813: JP76.1 -16.51,-20.95 -12.7,-17.14 -3.18,-17.14 13.33,-0.63 38.1,-0.63 B1.A5
  Bottom 1.27: B1.A5 C6.1
N$2  (via drill 0.6 pad 2.54)
  other vias: 15.87,-46.99
N$3  (via drill 0.6 pad 2.54)
  other vias: 12.7,-46.99
N$4  (via drill 0.6 pad 2.54)
  other vias: 19.05,-46.99
N$5  (via drill 0.6 pad 2.54)
  other vias: 22.22,-46.99
N$6  (via drill 0.6 pad 2.54)
  other vias: 6.35,-46.99
N$7  (via drill 0.6 pad 2.54)
  other vias: 9.52,-46.99
N$8  (via drill 0.6 pad 2.54)
  other vias: 31.75,-46.99
N$9  (via drill 0.6 pad 2.54)
  other vias: 34.92,-46.99
N$10  (via drill 0.6 pad 2.54)
  other vias: 50.8,-46.99
N$11  (via drill 0.6 pad 2.54)
  other vias: 66.67,-46.99
N$12  (via drill 0.6 pad 2.54)
  other vias: 69.85,-46.99
N$13  (via drill 0.6 pad 2.54)
  other vias: 76.2,-46.99
N$14  (via drill 0.6 pad 2.54)
  other vias: 60.32,-46.99
N$15  (via drill 0.6 pad 2.54)
  other vias: 82.55,-46.99
N$16  (via drill 0.6 pad 2.54)
  other vias: 53.97,-46.99
N$17  (via drill 0.6 pad 2.54)
  other vias: 73.02,-46.99
N$18  (via drill 0.6 pad 2.54)
  other vias: 28.57,-46.99
N$19  (via drill 0.6 pad 2.54)
  other vias: 38.1,-46.99
N$20  (via drill 0.6 pad 2.54)
  other vias: 41.27,-46.99
N$21  (via drill 0.6 pad 2.54)
  other vias: 25.4,-46.99
N$22  (via drill 0.6 pad 2.54)
  other vias: 44.45,-46.99
N$23  (via drill 0.6 pad 2.54)
  other vias: 47.62,-46.99
N$24  (via drill 0.6 pad 2.54)
  other vias: 63.5,-46.99
N$25  (via drill 0.6 pad 2.54)
  other vias: 57.15,-46.99
N$26  (via drill 0.6 pad 2.54)
  other vias: 92.07,-46.99
N$27  (via drill 0.6 pad 2.54)
  other vias: 98.42,-46.99
N$28  (via drill 0.6 pad 2.54)
  other vias: 101.6,-46.99
N$29  (via drill 0.6 pad 2.54)
  other vias: 85.72,-46.99
N$30  (via drill 0.6 pad 2.54)
  other vias: 79.37,-46.99
N$31  (via drill 0.6 pad 2.54)
  other vias: 95.25,-46.99
N$32  (via drill 0.6 pad 2.54)
  other vias: 88.9,-46.99
N$33  (via drill 0.6 pad 2.54)
  other vias: 104.77,-46.99
N$34
  Bottom 0.813: JP76.3 R5.2 -21.59,-25.4 -24.13,-22.86 R6.1
N$35
  Bottom 0.813: R2.1 -6.35,-22.86 -3.81,-25.4 R1.2 JP75.3
N$36
  Bottom 0.813: R3.1 -8.89,-22.86 -6.35,-25.4 R2.2 JP75.4
N$37
  Bottom 0.813: R4.1 -11.43,-22.86 -8.89,-25.4 R3.2 JP75.5
N$38
  Bottom 0.813: JP76.4 R6.2 -24.13,-25.4 -26.67,-22.86 R7.1
N$39
  Bottom 0.813: JP76.5 R7.2 -26.67,-25.4 -29.21,-22.86 R8.1
N$43
  Bottom 1.016: B1.RST 68.58,5.72 92.71,5.72 92.71,-1.27 95.88,-1.27 95.88,-4.45 JP79.2
ROW1  (via drill 0.6 pad 1.68)
  Top 1.422: v-31.12,62.23 v-24.77,62.23 v-18.42,62.23 v-12.07,62.23
  Bottom 1.016: B1.23 5.08,53.97 -9.53,53.97 -9.53,58.42 JP69.2
  Bottom 1.422: JP72.2 v-31.12,62.23 | JP71.2 v-24.77,62.23 | JP70.2 v-18.42,62.23 | v-12.07,62.23 JP69.2
ROW2  (via drill 0.6 pad 1.68)
  Top 1.422: v-31.12,54.61 v-24.77,54.61 v-18.42,54.61 v-12.07,54.61
  Bottom 1.016: B1.25 -8.89,45.72 -8.89,50.8 JP65.2
  Bottom 1.422: JP68.2 v-31.12,54.61 | JP67.2 v-24.77,54.61 | JP66.2 v-18.42,54.61 | v-12.07,54.61 JP65.2
ROW3  (via drill 0.6 pad 1.68)
  Top 1.422: v-31.12,46.99 v-24.77,46.99 v-18.42,46.99 v-12.07,46.99
  Bottom 1.016: B1.27 JP61.2
  Bottom 1.422: JP64.2 v-31.12,46.99 | JP63.2 v-24.77,46.99 | JP62.2 v-18.42,46.99 | v-12.07,46.99 JP61.2
ROW4  (via drill 0.6 pad 1.68)
  Top 1.422: v-31.12,39.37 v-24.77,39.37 v-18.42,39.37 v-12.07,39.37
  Bottom 1.016: B1.29 -8.89,40.64 -8.89,35.56 JP57.2
  Bottom 1.422: JP60.2 v-31.12,39.37 | JP59.2 v-24.77,39.37 | JP58.2 v-18.42,39.37 | v-12.07,39.37 JP57.2
ROW5  (via drill 0.6 pad 1.68)
  Top 1.422: v-31.12,31.75 v-24.77,31.75 v-18.42,31.75 v-12.07,31.75
  Bottom 1.016: B1.31 -6.99,38.1 -6.99,27.94 JP53.2
  Bottom 1.422: JP56.2 v-31.12,31.75 | JP55.2 v-24.77,31.75 | JP54.2 v-18.42,31.75 | v-12.07,31.75 JP53.2
ROW6  (via drill 0.6 pad 1.68)
  Top 1.422: v-31.12,24.13 v-24.77,24.13 v-18.42,24.13 v-12.07,24.13
  Bottom 1.016: B1.33 -5.08,35.56 -5.08,20.32 JP49.2
  Bottom 1.422: JP52.2 v-31.12,24.13 | JP51.2 v-24.77,24.13 | JP50.2 v-18.42,24.13 | v-12.07,24.13 JP49.2
ROW7  (via drill 0.6 pad 1.68)
  Top 1.422: v-31.12,16.51 v-24.77,16.51 v-18.42,16.51 v-12.07,16.51
  Bottom 1.016: B1.35 -3.18,33.02 -3.18,12.7 JP45.2
  Bottom 1.422: JP48.2 v-31.12,16.51 | JP47.2 v-24.77,16.51 | JP46.2 v-18.42,16.51 | v-12.07,16.51 JP45.2
ROW8  (via drill 0.6 pad 1.68)
  Top 1.422: v-31.12,8.89 v-24.77,8.89 v-18.42,8.89 v-12.07,8.89
  Bottom 1.016: B1.37 -1.27,30.48 -1.27,5.08 JP41.2
  Bottom 1.422: JP44.2 v-31.12,8.89 | JP43.2 v-24.77,8.89 | JP42.2 v-18.42,8.89 | v-12.07,8.89 JP41.2
ROW9  (via drill 0.6 pad 1.68)
  Top 1.422: v-31.12,1.27 v-24.77,1.27 v-18.42,1.27 v-12.07,1.27
  Bottom 1.016: B1.39 0.63,27.94 0.63,-2.54 JP37.2
  Bottom 1.422: JP40.2 v-31.12,1.27 | JP39.2 v-24.77,1.27 | JP38.2 v-18.42,1.27 | v-12.07,1.27 JP37.2
ROW10  (via drill 0.6 pad 1.68)
  Top 1.422: v-31.12,-6.35 v-24.77,-6.35 v-18.42,-6.35 v-12.07,-6.35
  Bottom 1.016: B1.41 2.54,25.4 2.54,-3.17 -2.54,-8.26 -12.07,-8.26
  Bottom 1.422: JP36.2 v-31.12,-6.35 | JP35.2 v-24.77,-6.35 | JP34.2 v-18.42,-6.35 | v-12.07,-6.35 -12.07,-8.26 JP33.2
S0  (via drill 0.6 pad 1.78, 0.6 pad 2.18, 0.6 pad 2.54)
  Top 0.813: v5.71,-17.14 v28.57,-17.14 v52.7,-17.14 v76.83,-17.14 | v76.83,-4.45 v76.83,11.43
  Bottom 0.813: IC1.11 76.83,-24.13 v76.83,-17.14 | IC3.11 52.7,-24.13 v52.7,-17.14 | IC4.11 28.57,-24.13 v28.57,-17.14 | IC2.11 5.71,-24.13 v5.71,-17.14 | B1.8 59.94,43.81 81.91,43.81 81.91,16.51 76.83,16.51 v76.83,11.43
  Bottom 1.27: v76.83,-17.14 v76.83,-4.45
S1  (via drill 0.6 pad 1.78, 0.6 pad 2.18, 0.6 pad 2.54)
  Top 0.813: v9.52,-14.6 v33.02,-14.6 v57.15,-14.6 v81.28,-14.6 | v81.28,-2.54 v81.28,11.43
  Bottom 0.813: IC1.10 81.28,-21.59 v81.28,-14.6 | IC3.10 57.15,-21.59 v57.15,-14.6 | IC4.10 33.02,-21.59 v33.02,-14.6 | IC2.10 9.52,-21.59 v9.52,-14.6 | B1.9 62.48,45.72 83.82,45.72 83.82,14.61 81.28,14.61 v81.28,11.43
  Bottom 1.27: v81.28,-14.6 v81.28,-2.54
S2  (via drill 0.6 pad 1.78, 0.6 pad 2.18, 0.6 pad 2.54)
  Top 0.813: v13.33,-12.06 v37.46,-12.06 v61.59,-12.06 v85.72,-12.06 | v85.72,-0.63 v85.72,11.43
  Bottom 0.813: IC1.9 v85.72,-12.06 | v61.59,-12.06 IC3.9 | IC4.9 v37.46,-12.06 | IC2.9 v13.33,-12.06 | v85.72,11.43 85.72,47.62 65.02,47.62 B1.10
  Bottom 1.27: v85.72,-12.06 v85.72,-0.63
SHIFT1
  Bottom 0.813: B1.6 JP77.2
SHIFT2
  Bottom 0.813: JP78.2 53.97,66.04 55.88,64.14 B1.7
(copper drawn outside any net)
  shapes: Bottom circle x4

### Text on the board
Bottom: ASH DJ Controller
tTest: EncoderB | SHIFT2 | SHIFT1 | EncoderA | MODE1 | MODE2 | KEYMATRIX | MODE2 | MODE1 | MODE2 | MODE1 | FADERS